# Altium schematic sheet LEGO_VL53L1X_Sensor.SchDoc
size A4; DocumentNumber: 1; SheetNumber: 1; SheetTotal: 6; sheetTitle: Main
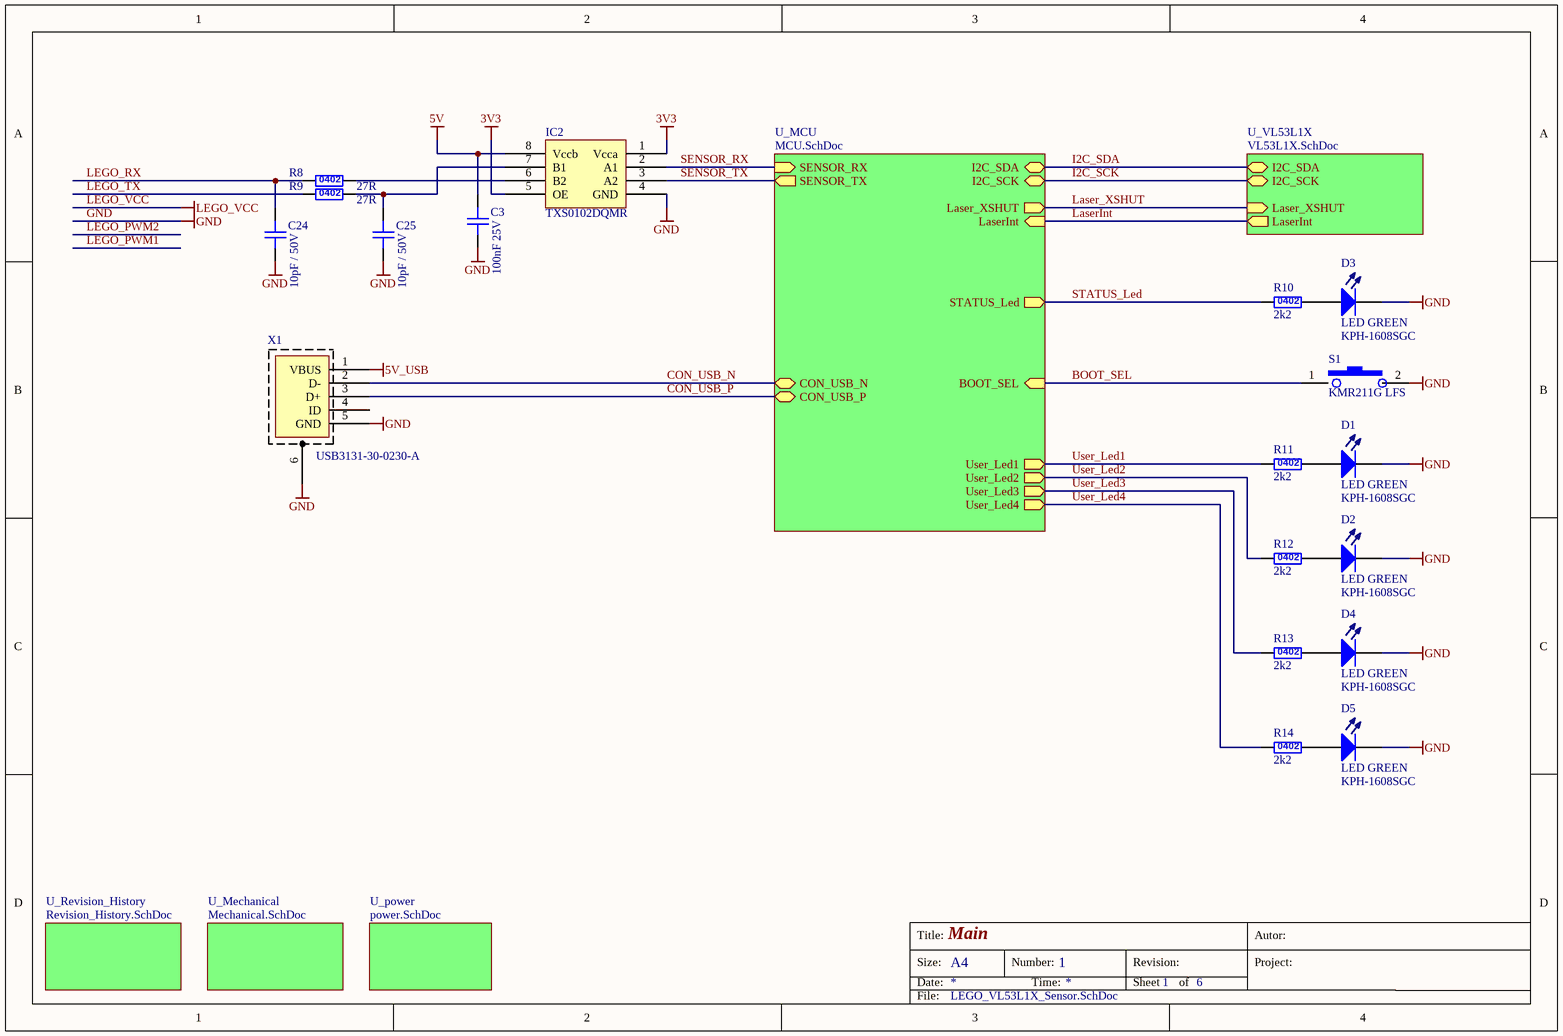
[diagram p0: LEGO_VL53L1X_Sensor.SchDoc]

## Parts
C3  value 100nF 25V  [C0402]  (hidden comment: UniversalCapacitor)
C24  value 10pF / 50V  [C0402]  (hidden comment: UniversalCapacitor)
C25  value 10pF / 50V  [C0402]  (hidden comment: UniversalCapacitor)
D1  LED GREEN  value KPH-1608SGC  [LED0603]
D2  LED GREEN  value KPH-1608SGC  [LED0603]
D3  LED GREEN  value KPH-1608SGC  [LED0603]
D4  LED GREEN  value KPH-1608SGC  [LED0603]
D5  LED GREEN  value KPH-1608SGC  [LED0603]
IC2  TXS0102DQMR  [X2SON-8_1.8x1.2]
R8  value 27R  [R0402]  (hidden comment: UniversalResistor0402)
R9  value 27R  [R0402]  (hidden comment: UniversalResistor0402)
R10  value 2k2  [R0402]  (hidden comment: UniversalResistor0402)
R11  value 2k2  [R0402]  (hidden comment: UniversalResistor0402)
R12  value 2k2  [R0402]  (hidden comment: UniversalResistor0402)
R13  value 2k2  [R0402]  (hidden comment: UniversalResistor0402)
R14  value 2k2  [R0402]  (hidden comment: UniversalResistor0402)
S1  value KMR211G LFS  [ButtonKMR2]  (hidden comment: PushButton)
X1  value USB3131-30-0230-A  [USB3131-XX-0230-X]  (hidden comment: USB)

## Sub-sheets
U_MCU = MCU.SchDoc: I2C_SDA (bidir), I2C_SCK (bidir), Laser_XSHUT (out), LaserInt (in), SENSOR_TX (out), SENSOR_RX (in), STATUS_Led (out), BOOT_SEL (in), CON_USB_P (bidir), CON_USB_N (bidir), User_Led1 (out), User_Led2 (out), User_Led3 (out), User_Led4 (out)
U_Mechanical = Mechanical.SchDoc: no entries
U_power = power.SchDoc: no entries
U_Revision_History = Revision_History.SchDoc: no entries
U_VL53L1X = VL53L1X.SchDoc: Laser_XSHUT (in), LaserInt (out), I2C_SDA (bidir), I2C_SCK (bidir)

## Nets
3V3: IC2.1(Vcca) IC2.5(OE)
5V: C3.2 IC2.8(Vccb)
5V_USB: X1.1(VBUS)
GND: C3.1 C24.2 C25.2 D1.2(K) D2.2(K) D3.2(K) D4.2(K) D5.2(K) IC2.4(GND) S1.2 X1.5(GND) X1.6
BOOT_SEL: S1.1 ; sheet U_MCU/BOOT_SEL
CON_USB_N: X1.2(D-) ; sheet U_MCU/CON_USB_N
CON_USB_P: X1.3(D+) ; sheet U_MCU/CON_USB_P
I2C_SCK: sheet U_VL53L1X/I2C_SCK, sheet U_MCU/I2C_SCK
I2C_SDA: sheet U_VL53L1X/I2C_SDA, sheet U_MCU/I2C_SDA
Laser_XSHUT: sheet U_VL53L1X/Laser_XSHUT, sheet U_MCU/Laser_XSHUT
LaserInt: sheet U_VL53L1X/LaserInt, sheet U_MCU/LaserInt
LEGO_RX: C24.1 R8.2
LEGO_TX: R9.2
SENSOR_RX: IC2.2(A1) ; sheet U_MCU/SENSOR_RX
SENSOR_TX: IC2.3(A2) ; sheet U_MCU/SENSOR_TX
STATUS_Led: R10.2 ; sheet U_MCU/STATUS_Led
User_Led1: R11.2 ; sheet U_MCU/User_Led1
User_Led2: R12.2 ; sheet U_MCU/User_Led2
User_Led3: R13.2 ; sheet U_MCU/User_Led3
User_Led4: R14.2 ; sheet U_MCU/User_Led4
NetC25_1: C25.1 IC2.7(B1) R9.1
NetD1_1: D1.1(A) R11.1
NetD2_1: D2.1(A) R12.1
NetD3_1: D3.1(A) R10.1
NetD4_1: D4.1(A) R13.1
NetD5_1: D5.1(A) R14.1
NetIC2_6: IC2.6(B2) R8.1

Not connected (* = marked no-connect by the designer): X1 4(ID)

## Notes on the sheet
- Title:
- Size:
- Date:
- A4
- Number:
- Time:
- Revision:
- Sheet
- of
- Autor:
- Project:
- File:
- (in symbol CRCW04022K20FKED) 0402
- (in symbol CRCW040227R0FKED) 0402

## Library data of the parts
C3 = 0402B104K250CT: WALSIN - 0402B104K250CT - CAPACITOR, MLCC, X7R, 0.1UF, 25V, 0402; part_id: 2099; name: 0402B104K250CT; Supplier 1: Farnell; Supplier Part Number 1: 2496772; ComponentLink1URL: http://cz.farnell.com/2496772?Ntt=2496772; HelpURL: http://www.farnell.com/datasheets/2340522.pdf; footprint_name: C0402; schematic_name: UniversalCapacitor
C24 C25 = C0402C100D5GAC: Kategorie produktu:	Vícevrstvé keramické kondenzátory MLCC – pro povrchovou montáž SMD, SMT / Výrobce:	KEMET / RoHS::	V souladu RoHS Údaje / Série:	C-C / Kapacita:	10 pF / Jmenovité napětí (DC) stejnosměrného proudu	:	50 VDC / Dielektrikum:	C0G (NP0) / Tolerance:	0.5 pF / Kód pouzdra - palce:	0402 / Kód pouzdra - mm:	1005 / Výška:	- / Maximální provozní teplota:	+ 125 C / Minimální provozní teplota:	- 55 C / Koncovka:	- / Výrobek:	General Type MLCCs / Obal:	Cut Tape / Obal:	MouseReel / Obal:	Ree; part_id: 2258; name: C0402C100D5GAC; Supplier 1: Mouser; Supplier Part Number 1: 80-C0402C100D5GAC; ComponentLink1URL: https://cz.mouser.com/ProductDetail/KEMET/C0402C100D5GAC/?qs=sGAEpiMZZMu0f%252bT2bkVfuj0aSb%252bMTiHU; HelpURL: http://www.mouser.com/ds/2/212/KEM_C1003_C0G_SMD-1101588.pdf; footprint_name: C0402; schematic_name: UniversalCapacitor
D1-D5 = KPH-1608SGC: KINGBRIGHT - KPH-1608SGC - LED, GREEN, 12MCD, 568NM, SMD LED 0603 zelená; part_id: 980; name: KPH-1608SGC; Supplier 1: Farnell; Supplier Part Number 1: 2426215; ComponentLink1URL: http://cz.farnell.com/2426215?Ntt=2426215; HelpURL: http://www.farnell.com/datasheets/1821279.pdf; footprint_name: LED0603; schematic_name: LED
IC2 = TXS0102DQMR: TEXAS INSTRUMENTS - TXS0102DQMR - Voltage Level Translator, 2 Inputs, 4.2ns, 1.65V to 5.5V, X2SON-8; part_id: 2969; name: TXS0102DQMR; Value: TXS0102DQMR; Supplier 1: Farnell; Supplier Part Number 1: 3050430; ComponentLink1URL: http://cz.farnell.com/3050430?Ntt=3050430; footprint_name: X2SON-8_1.8x1.2; schematic_name: TXS0102DQMR
R8 R9 = CRCW040227R0FKED: VISHAY - CRCW040227R0FKED. - SMD Chip Resistor, 27 ohm, ± 1%, 62.5 mW, 0402 [1005 Metric], Thick Film, General Purpose; name: CRCW040227R0FKED; Supplier 1: Farnell; Supplier Part Number 1: 2140614; ComponentLink1URL: http://cz.farnell.com/2140614?Ntt=2140614; HelpURL: http://www.farnell.com/datasheets/2310790.pdf
R10-R14 = CRCW04022K20FKED: VISHAY - CRCW04022K20FKED. - RES, THICK FILM, 2K2, 1%, 0.063W, 0402; name: CRCW04022K20FKED; Supplier 1: Farnell; Supplier Part Number 1: 2140802; ComponentLink1URL: http://cz.farnell.com/2140802?Ntt=2140802; HelpURL: http://www.farnell.com/datasheets/2310790.pdf
S1 = KMR211G LFS: C & K COMPONENTS - KMR211G LFS - SWITCH, SPST, 0.05A, 32VDC, SMD; part_id: 1256; name: KMR211G LFS; Supplier 1: Farnell; Supplier Part Number 1: 1437635; ComponentLink1URL: http://cz.farnell.com/1437635?Ntt=1437635; HelpURL: http://www.farnell.com/datasheets/1697814.pdf; footprint_name: ButtonKMR2; schematic_name: PushButton
X1 = USB3131-30-0230-A: GCT (GLOBAL CONNECTOR TECHNOLOGY) - USB3131-30-0230-A - USB Connector, Micro USB Type B, USB 2.0, Receptacle, 5 Ways, Through Hole Mount, Vertical; part_id: 2968; Supplier 1: Farnell; ComponentLink1URL: http://cz.farnell.com/2537022?Ntt=2537022; ComponentLink1Description: http://www.farnell.com/datasheets/1359588.pdf; ComponentLink2URL: http://www.adam-tech.com/rick/FinalSingle/CatPg133-134.pdf; ComponentLink2Description: http://www.adam-tech.com/rick/FinalSingle/CatPg133-134.pdf; Pricing: 1=20,954, 100=15,959, 250=14,315, 500=13,066, 1000=12,031 (EUR); Supplier Part Number 1: 2537022; name: USB3131-30-0230-A; HelpURL: http://www.farnell.com/datasheets/2342944.pdf; footprint_name: USB3131-XX-0230-X; schematic_name: MUSB